# Altium schematic sheet ljus sch.SchDoc
size A4
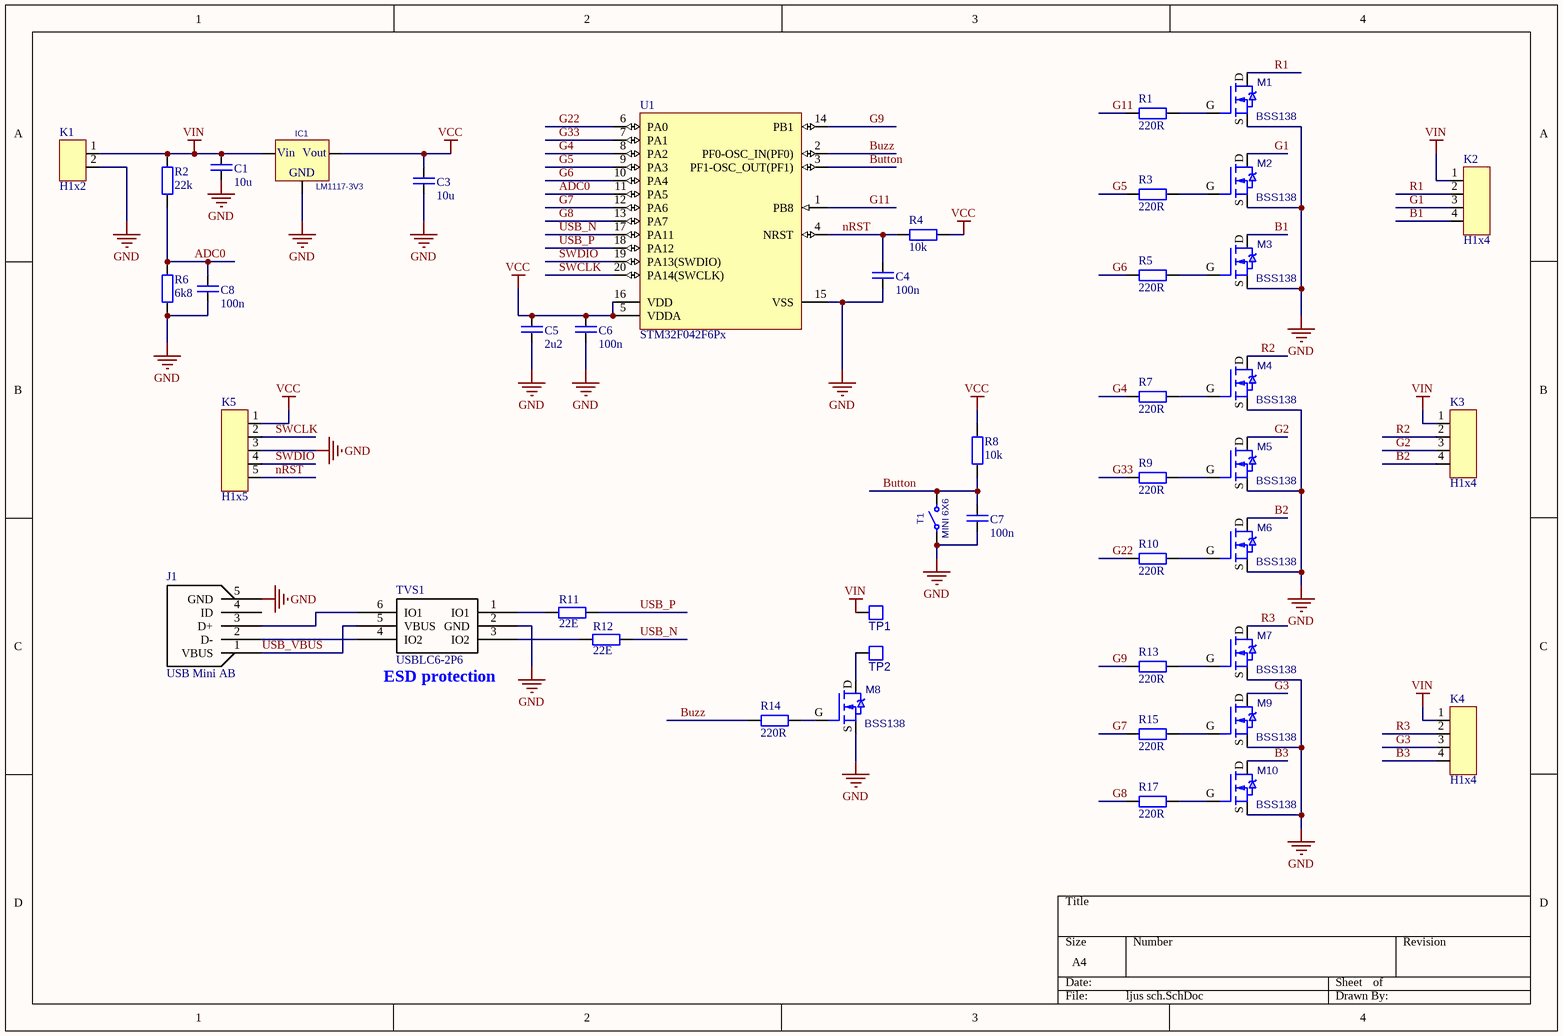
[diagram p0: ljus sch.SchDoc]

## Parts
C1  10u  [C0805(2012)_M]
C3  10u  [C0805(2012)_M]
C4  100n  [0603]
C5  2u2  [0603]
C6  100n  [0603]
C7  100n  [0603]
C8  100n  [0603]
IC1  LM1117-3V3  [SOT233]
J1  USB Mini AB  [USB3131-30-0230-A]
K1  H1x2  [XT-30]
K2  H1x4  [H1x4]
K3  H1x4  [H1x4]
K4  H1x4  [H1x4]
K5  H1x5  [H1x5]
M1  BSS138  [SOT23-BSS138]
M2  BSS138  [SOT23-BSS138]
M3  BSS138  [SOT23-BSS138]
M4  BSS138  [SOT23-BSS138]
M5  BSS138  [SOT23-BSS138]
M6  BSS138  [SOT23-BSS138]
M7  BSS138  [SOT23-BSS138]
M8  BSS138  [SOT23-BSS138]
M9  BSS138  [SOT23-BSS138]
M10  BSS138  [SOT23-BSS138]
R1  220R  [0603]
R2  22k  [0603]
R3  220R  [0603]
R4  10k  [0603]
R5  220R  [0603]
R6  6k8  [0603]
R7  220R  [0603]
R8  10k  [0603]
R9  220R  [0603]
R10  220R  [0603]
R11  22E  [0603]
R12  22E  [0603]
R13  220R  [0603]
R14  220R  [0603]
R15  220R  [0603]
R17  220R  [0603]
T1  MINI 6X6  [SW 5x6 SMD SHORT]
TP1  PAD  [PAD_CIRC_HOLE]  (value not drawn)
TP2  PAD  [PAD_CIRC_HOLE]  (value not drawn)
TVS1  USBLC6-2P6  [SOT23127P600-8N]
U1  STM32F042F6Px  [STM-TSSOP20_M]

## Nets
GND: C1.2 C3.2 C4.2 C5.2 C6.2 C7.2 C8.2 IC1.GND J1.5(GND) K1.2 K5.3 M1.S M2.S M3.S M4.S M5.S M6.S M7.S M8.S M9.S M10.S R6.2 T1.1 TVS1.2(GND) U1.15(VSS)
VCC: C3.1 C5.1 C6.1 IC1.OUT K5.1 R4.2 R8.2 U1.5(VDDA) U1.16(VDD)
VIN: C1.1 IC1.IN K1.1 K2.1 K3.1 K4.1 R2.1 TP1.1
ADC0: C8.1 R2.2 R6.1 U1.11(PA5)
B1: K2.4 M3.D
B2: K3.4 M6.D
B3: K4.4 M10.D
Button: C7.1 R8.1 T1.2 U1.3(PF1-OSC_OUT(PF1))
Buzz: R14.1 U1.2(PF0-OSC_IN(PF0))
G1: K2.3 M2.D
G2: K3.3 M5.D
G3: K4.3 M9.D
G4: R7.1 U1.8(PA2)
G5: R3.1 U1.9(PA3)
G6: R5.1 U1.10(PA4)
G7: R15.1 U1.12(PA6)
G8: R17.1 U1.13(PA7)
G9: R13.1 U1.14(PB1)
G11: R1.1 U1.1(PB8)
G22: R10.1 U1.6(PA0)
G33: R9.1 U1.7(PA1)
nRST: C4.1 K5.5 R4.1 U1.4(NRST)
R1: K2.2 M1.D
R2: K3.2 M4.D
R3: K4.2 M7.D
SWCLK: K5.2 U1.20(PA14(SWCLK))
SWDIO: K5.4 U1.19(PA13(SWDIO))
USB_N: R12.1 U1.17(PA11)
USB_P: R11.1 U1.18(PA12)
USB_VBUS: J1.1(VBUS) TVS1.5(VBUS)
NetJ1_2: J1.2(D-) TVS1.4(IO2)
NetJ1_3: J1.3(D+) TVS1.6(IO1)
NetM1_G: M1.G R1.2
NetM2_G: M2.G R3.2
NetM3_G: M3.G R5.2
NetM4_G: M4.G R7.2
NetM5_G: M5.G R9.2
NetM6_G: M6.G R10.2
NetM7_G: M7.G R13.2
NetM8_D: M8.D TP2.1
NetM8_G: M8.G R14.2
NetM9_G: M9.G R15.2
NetM10_G: M10.G R17.2
NetR11_2: R11.2 TVS1.1(IO1)
NetR12_2: R12.2 TVS1.3(IO2)

Not connected (* = marked no-connect by the designer): J1 4(ID)

## Notes on the sheet
- (near TVS1) ESD protection
- (in symbol LM1117-3V3) Vin; Vout

## Library data of the parts
C1 C3-C8 = C: Capacitor
IC1 = LM1117-3V3: pin to pad: GND>1 IN>3 OUT>2; Value: *
J1 = USB Mini AB: SOCKET, USB MINI-AB THRU HOLE; Manufacturer: MOLEX; Part number: 565790511; Farnel: http://uk.farnell.com/jsp/endecaSearch/partDetail.jsp?SKU=4768292&N=401
K1 = H1x2: Header 1x2 (male)
K2-K4 = H1x4: Header 1x4 (male)
K5 = H1x5: Header 1x5 (male)
M1-M10 = BSS138: pin to pad: D>3 G>1 S>2; Value: {Value}
R1-R10 R13-R15 R17 = R
R11 R12 = Res2: Resistor; Published: 8-Jun-2000; LatestRevisionDate: 17-Jul-2002; LatestRevisionNote: Re-released for DXP Platform.; PackageReference: AXIAL-0.4; Publisher: Altium Limited; PackageDescription: Axial Device, Thru-Hole; 2 Leads; 0.4 in Pin Spacing
T1 = MINI 6X6: pin to pad: 1>1+4 2>2+3; Value: *